# EAGLE design Teensy-Futurlec-Shield (EAGLE 6.2)
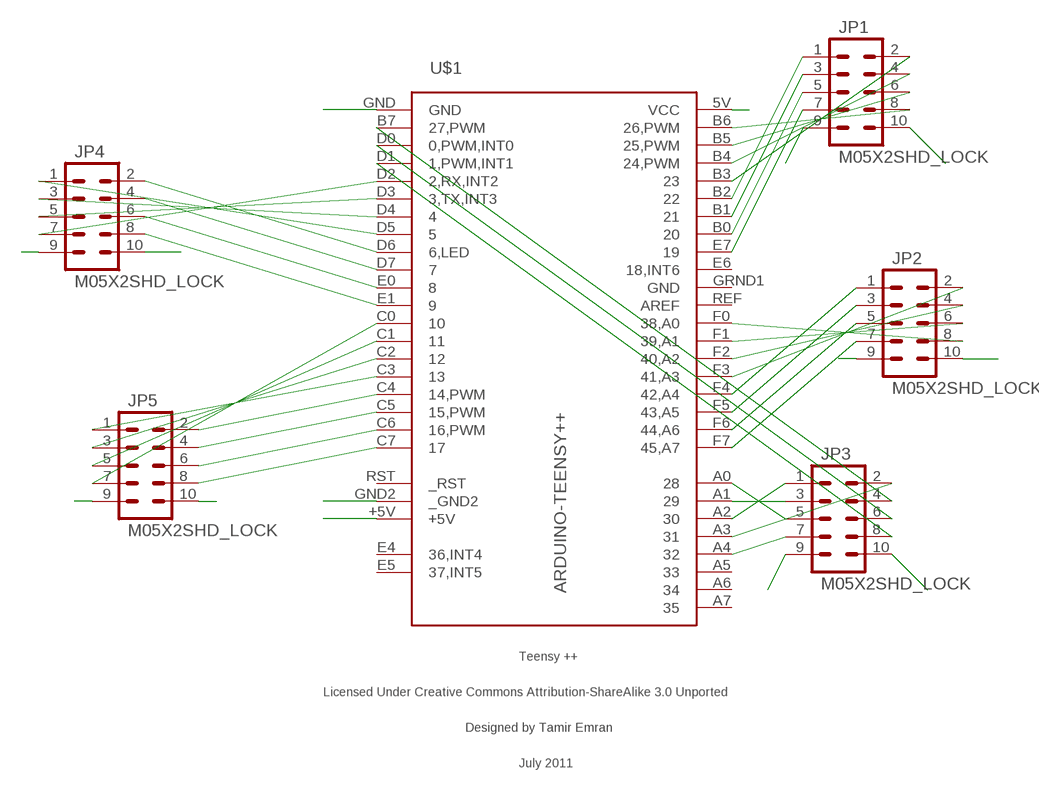
[diagram p0: schematic, sheet 1]

## Parts
JP1  M05X2SHD_LOCK  [2X5-SHROUDED_LOCK]
JP2  M05X2SHD_LOCK  [2X5-SHROUDED_LOCK]
JP3  M05X2SHD_LOCK  [2X5-SHROUDED_LOCK]
JP4  M05X2SHD_LOCK  [2X5-SHROUDED_LOCK]
JP5  M05X2SHD_LOCK  [2X5-SHROUDED_LOCK]
U$1  ARDUINO-TEENSY++  [TEENSY++]

## Nets
GND: JP1.10 JP2.10 JP3.10 JP4.10 JP5.10 U$1.GND U$1.GND2(_GND2)
N$1: JP1.8 U$1.B6(26,PWM)
N$2: JP1.6 U$1.B5(25,PWM)
N$3: JP1.4 U$1.B4(24,PWM)
N$4: JP1.2 U$1.B3
N$5: JP1.1 U$1.B2
N$6: JP1.3 U$1.B1
N$7: JP1.5 U$1.B0
N$8: JP1.7 U$1.E7
N$9: JP2.6 U$1.F1(39,A1)
N$10: JP2.8 U$1.F0(38,A0)
N$11: JP2.4 U$1.F2(40,A2)
N$12: JP2.2 U$1.F3(41,A3)
N$13: JP2.1 U$1.F4(42,A4)
N$14: JP2.3 U$1.F5(43,A5)
N$15: JP2.5 U$1.F6(44,A6)
N$16: JP2.7 U$1.F7(45,A7)
N$17: JP5.8 U$1.C7
N$18: JP5.6 U$1.C6(16,PWM)
N$19: JP5.4 U$1.C5(15,PWM)
N$20: JP5.2 U$1.C4(14,PWM)
N$21: JP5.1 U$1.C3
N$22: JP5.3 U$1.C2
N$23: JP5.5 U$1.C1
N$24: JP5.7 U$1.C0
N$25: JP4.1 U$1.D5
N$26: JP4.3 U$1.D4
N$27: JP4.5 U$1.D3(3,TX,INT3)
N$28: JP4.7 U$1.D2(2,RX,INT2)
N$29: JP4.8 U$1.E1
N$30: JP4.6 U$1.E0
N$31: JP4.4 U$1.D7
N$32: JP4.2 U$1.D6(6,LED)
N$33: JP3.8 U$1.D1(1,PWM,INT1)
N$34: JP3.2 U$1.A3
N$35: JP3.6 U$1.D0(0,PWM,INT0)
N$36: JP3.4 U$1.B7(27,PWM)
N$37: JP3.5 U$1.A0
N$38: JP3.3 U$1.A1
N$39: JP3.1 U$1.A2
N$40: JP3.7 U$1.A4
VCC: JP1.9 JP2.9 JP3.9 JP4.9 JP5.9 U$1.5V(VCC) U$1.+5V
Unconnected: U$1.A5 U$1.A6 U$1.A7 U$1.E4(36,INT4) U$1.E5(37,INT5) U$1.E6(18,INT6) U$1.REF(AREF) U$1.RST(_RST)

## Power pins joined to a net without a drawn wire
GND: U$1.GRND1(GND)

## Library data of the parts
JP1-JP5 = SparkFun:M05X2: Header 5x2 Standard 10-pin dual row 0.1" header. Commonly used with AVR-ISP. Use with Spark Fun Electronics SKU: PRT-00778
U$1 = teensypp:ARDUINO-TEENSY++: Teensy ++ Original Design by Mark Gross Modified Design by Tamir Emran Licensed Under Creative Commons Attribution-ShareAlike 3.0 Unported (CC BY-SA 3.0)

## Board
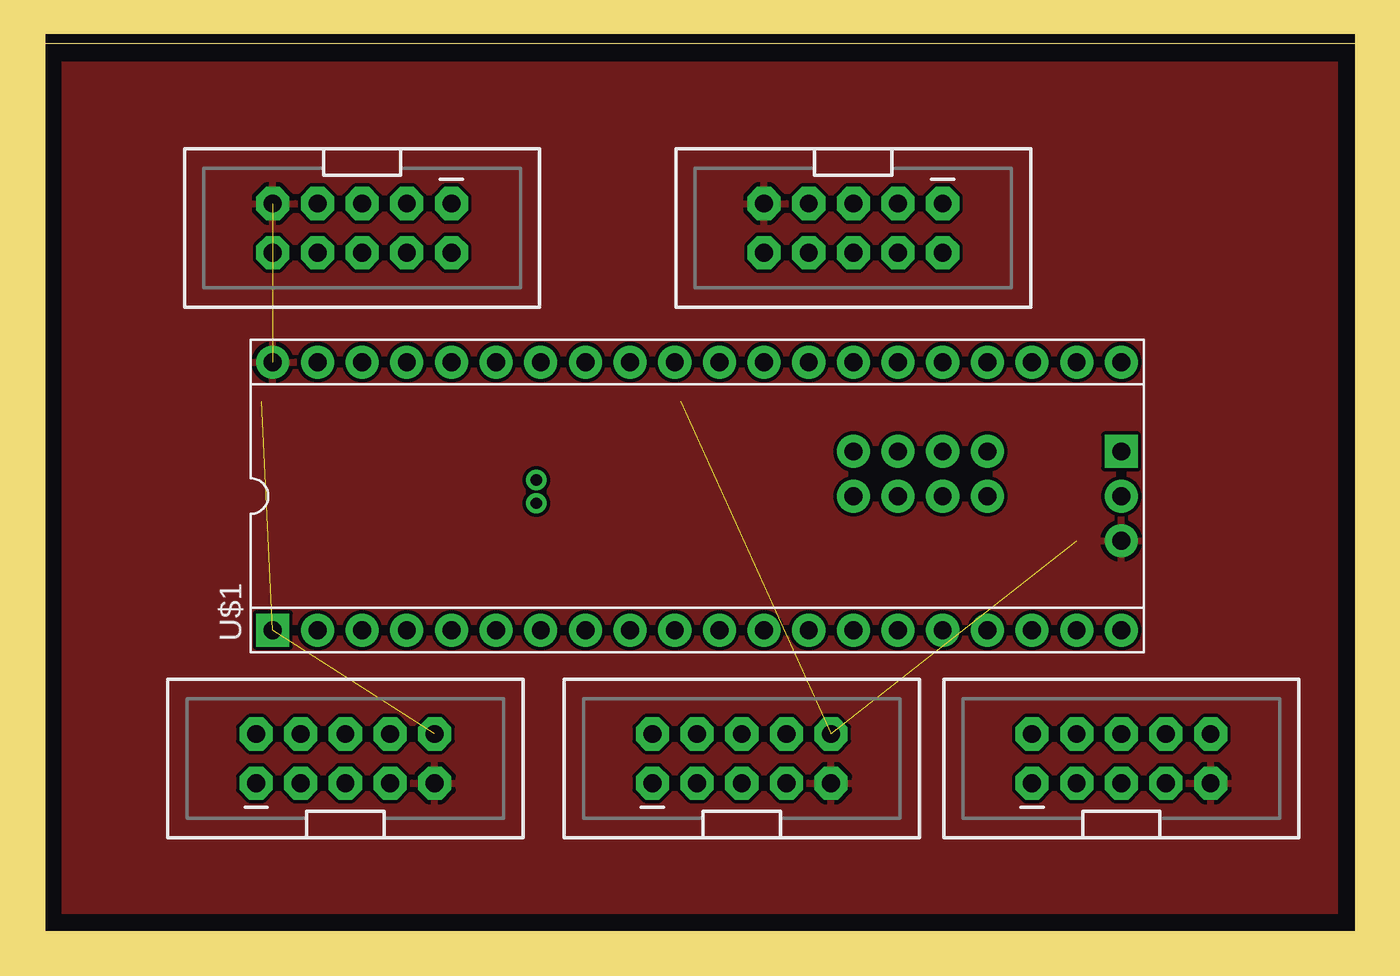
[diagram p1: board, top side]
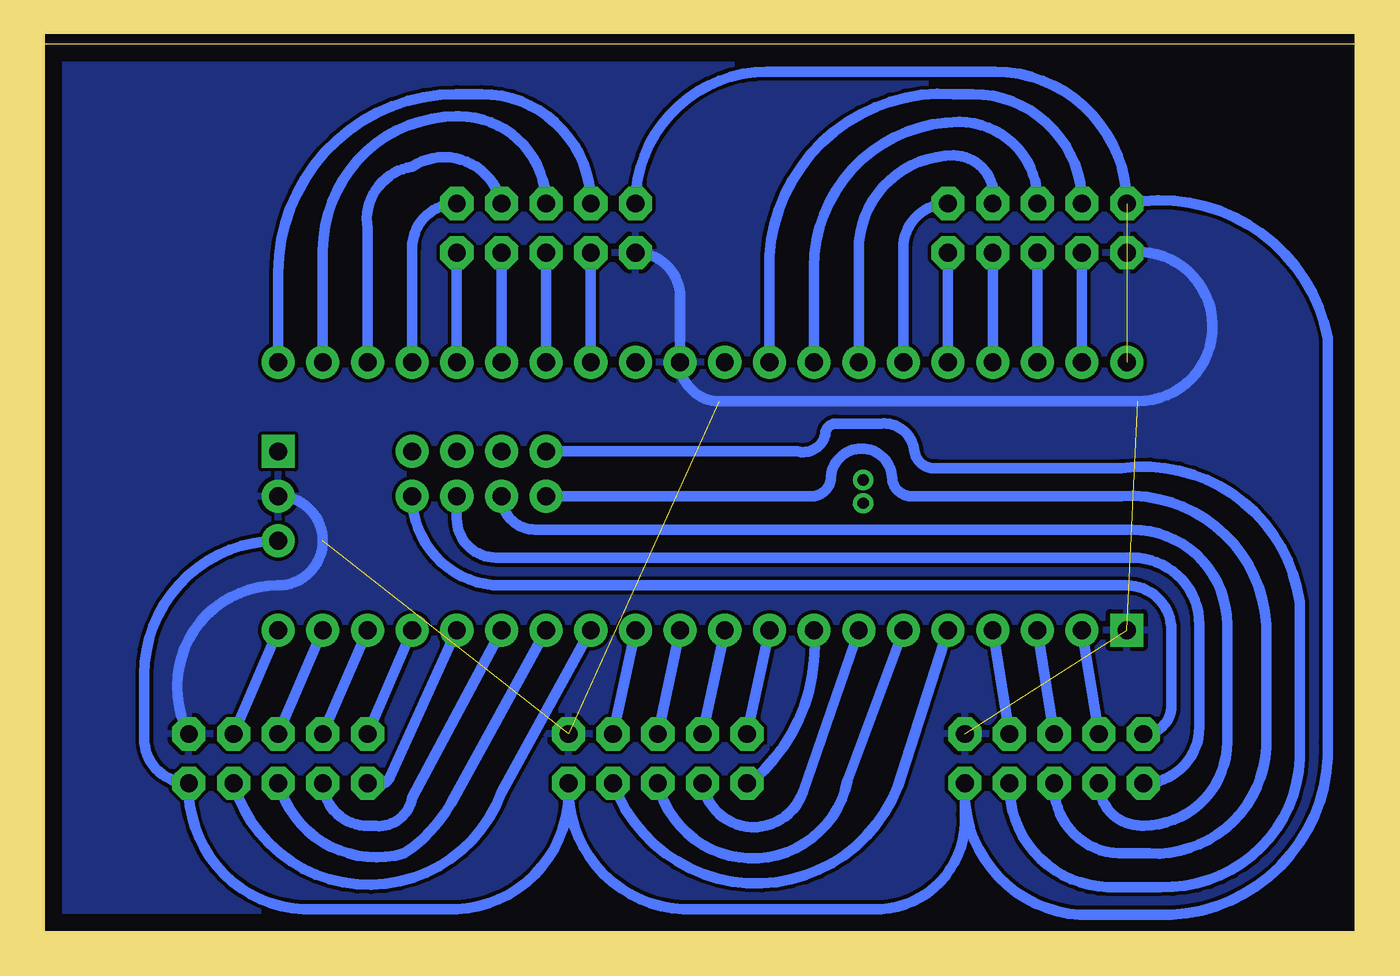
[diagram p2: board, bottom side, seen from below]

Size 74.6 x 50.47 mm. Coordinates in mm from the lower left corner, seen from the top.
Outline: 0,0 74.6,0 74.6,50.47 0,50.47 0,0
Copper layers (1*16): Top 0.035mm / dielectric 1.5mm / Bottom 0.035mm
Design rules: minimum track width 10mil, minimum drill 24mil, track to track 8mil, track to pad 8mil, pad to pad 8mil, via to via 8mil, smd to smd 8mil, copper to edge 40mil, drill to drill 8mil, minimum pad ring 10mil, minimum via ring 8mil, stop-mask expansion 4mil, vias tented up to drill 0mil, thermal gap 10mil
Milling: 4 lines

### Footprints (pad centres in the part's own frame; a part is rotated, then mirrored left to right if it is on the bottom)
2X5-SHROUDED_LOCK = drill 1.016 pad 1.88 octagon: 1 -1.397,5.08; 2 1.397,5.08; 3 -1.397,2.54; 4 1.397,2.54; 5 -1.397,0; 6 1.397,0; 7 -1.397,-2.54; 8 1.397,-2.54; 9 -1.397,-5.08; 10 1.397,-5.08
TEENSY++ = drill 1.016 pad 1.88: 5V 24.13,-2.54; +5V -24.13,7.62; A0 8.89,0; A1 11.43,0; A2 13.97,0; A3 16.51,0; A4 8.89,2.54; A5 11.43,2.54; A6 13.97,2.54; A7 16.51,2.54; B0 -6.35,7.62; B1 -8.89,7.62; B2 -11.43,7.62; B3 -13.97,7.62; B4 -16.51,7.62; B5 -19.05,7.62; B6 -21.59,7.62; B7 -21.59,-7.62; C0 6.35,-7.62; C1 8.89,-7.62; C2 11.43,-7.62; C3 13.97,-7.62; C4 16.51,-7.62; C5 19.05,-7.62; C6 21.59,-7.62; C7 24.13,-7.62; D0 -19.05,-7.62; D1 -16.51,-7.62; D2 -13.97,-7.62; D3 -11.43,-7.62; D4 -8.89,-7.62; D5 -6.35,-7.62; D6 -3.81,-7.62; D7 -1.27,-7.62; E0 1.27,-7.62; E1 3.81,-7.62; E6 -1.27,7.62; E7 -3.81,7.62; F0 6.35,7.62; F1 8.89,7.62; F2 11.43,7.62; F3 13.97,7.62; F4 16.51,7.62; F5 19.05,7.62; F6 21.59,7.62; F7 24.13,7.62; GND2 24.13,0; GRND1 1.27,7.62; REF 3.81,7.62 | drill 0.635 pad 1.067: E4 -9.144,0.914; E5 -9.144,-0.406 | drill 1.016 pad 1.88 square: GND -24.13,-7.62; RST 24.13,2.54

### Placement (x,y rotation side)
JP1  18.1,40.01 270 top
JP2  46.04,40.01 270 top
JP3  17.14,9.84 90 top
JP4  39.69,9.84 90 top
JP5  61.28,9.84 90 top
U$1  37.15,24.77 0 top

### Tracks (layer width: path | path; a pad name or v marks a point on that pad's centre or on a via)
GND  (4 unrouted)
  Bottom 0.61: JP2.10 arc90 38.42,36.07 U$1.GRND1 arc-90 36.2,30.16 12.38,30.16 arc-189 JP1.10 | U$1.GND2 arc90 58.74,22.23 arc90 61.28,19.68 arc-118 JP5.10
  pour Bottom: 0,50.8 73.66,50.8 73.66,0 0,0
N$1
  Bottom 0.61: U$1.B6 JP1.8
N$2
  Bottom 0.61: JP1.6 U$1.B5
N$3
  Bottom 0.61: U$1.B4 JP1.4
N$4
  Bottom 0.61: U$1.B3 JP1.2
N$5
  Bottom 0.61: U$1.B2 25.72,38.86 arc90 JP1.1
N$6
  Bottom 0.61: U$1.B1 28.26,38.73 arc90 22.86,44.13 arc102 JP1.3
N$7
  Bottom 0.61: U$1.B0 30.8,37.78 arc90 22.54,46.04 arc92 JP1.5
N$8
  Bottom 0.61: U$1.E7 33.34,38.42 arc90 22.86,47.62 21.78,47.62 arc90 JP1.7
N$9
  Bottom 0.61: U$1.F1 JP2.6
N$10
  Bottom 0.61: U$1.F0 JP2.8
N$11
  Bottom 0.61: U$1.F2 JP2.4
N$12
  Bottom 0.61: JP2.2 U$1.F3
N$13
  Bottom 0.61: U$1.F4 53.66,38.86 arc90 JP2.1
N$14
  Bottom 0.61: U$1.F5 56.2,40.01 arc90 53.66,43.5 arc111 JP2.3
N$15
  Bottom 0.61: U$1.F6 58.74,38.73 arc90 51.12,46.35 50.99,46.35 arc90 JP2.5
N$16
  Bottom 0.61: U$1.F7 61.28,37.47 arc90 51.12,47.62 49.72,47.62 arc90 JP2.7
N$17
  Bottom 0.61: U$1.C7 JP5.8
N$18
  Bottom 0.61: U$1.C6 JP5.6
N$19
  Bottom 0.61: U$1.C5 JP5.4
N$20
  Bottom 0.61: U$1.C4 JP5.2
N$21
  Bottom 0.61: U$1.C3 54.93,8.76 arc90 JP5.1
N$22
  Bottom 0.61: U$1.C2 53.66,7.62 arc90 55.88,6.03 arc94 JP5.3
N$23
  Bottom 0.61: JP5.5 arc-90 54.1,4.45 arc-25 51.44,7.3 U$1.C1
N$24
  Bottom 0.61: U$1.C0 48.58,7.94 arc144 JP5.7
N$25
  Bottom 0.61: JP4.1 34.29,8.57 arc-54 U$1.D5
N$26
  Bottom 0.61: U$1.D4 31.43,7.94 arc152 JP4.3
N$27
  Bottom 0.61: U$1.D3 28.89,8.57 arc155 JP4.5
N$28
  Bottom 0.61: U$1.D2 26.04,8.26 arc139 JP4.7
N$29
  Bottom 0.61: U$1.E1 JP4.8
N$30
  Bottom 0.61: U$1.E0 JP4.6
N$31
  Bottom 0.61: U$1.D7 JP4.4
N$32
  Bottom 0.61: U$1.D6 JP4.2
N$33
  Bottom 0.61: U$1.D1 JP3.8
N$34
  Bottom 0.61: U$1.A3 arc-90 48.58,19.68 13.02,19.68 arc90 10.48,17.14 10.48,12.83 arc90 JP3.2
N$35
  Bottom 0.61: U$1.D0 JP3.6
N$36
  Bottom 0.61: U$1.B7 JP3.4
N$37
  Bottom 0.61: U$1.A0 31.11,24.77 arc-90 29.84,25.72 arc180 26.35,25.72 arc-90 25.08,24.77 13.34,24.77 arc90 5.08,17.46 5.08,10.48 arc90 11.75,4.45 13.46,4.45 arc90 JP3.5
N$38
  Bottom 0.61: U$1.A1 arc-90 46.67,22.86 12.7,22.86 arc90 7.3,17.46 7.3,10.79 arc90 12.06,6.03 12.19,6.03 arc90 JP3.3
N$39
  Bottom 0.61: U$1.A2 51.12,23.5 arc-90 48.9,21.27 12.7,21.27 arc90 8.89,17.46 8.89,11.62 arc90 JP3.1
N$40
  Bottom 0.61: U$1.A4 31.75,27.3 arc-90 30.16,28.26 arc90 29.53,28.89 26.99,28.89 arc90 25.08,27.3 arc-90 23.81,26.35 13.34,26.35 arc90 3.17,18.73 3.17,9.84 arc90 11.11,2.54 14.1,2.54 arc90 JP3.7
VCC  (1 unrouted)
  Bottom 0.61: JP2.9 arc90 33.47,48.9 20.51,48.9 arc90 JP1.9 arc90 1.59,33.78 1.59,10.79 arc90 10.48,0.95 15.68,0.95 arc90 JP3.9 22.23,6.67 arc90 26.99,1.27 38.23,1.27 arc90 JP4.9 44.77,8.26 arc90 51.12,1.27 59.82,1.27 arc90 JP5.9 | 66.36,8.26 JP5.9 | JP5.9 arc90 68.9,10.99 68.9,14.61 arc90 U$1.5V
  pour Top: 0,50.8 73.66,50.8 73.66,0 0,0